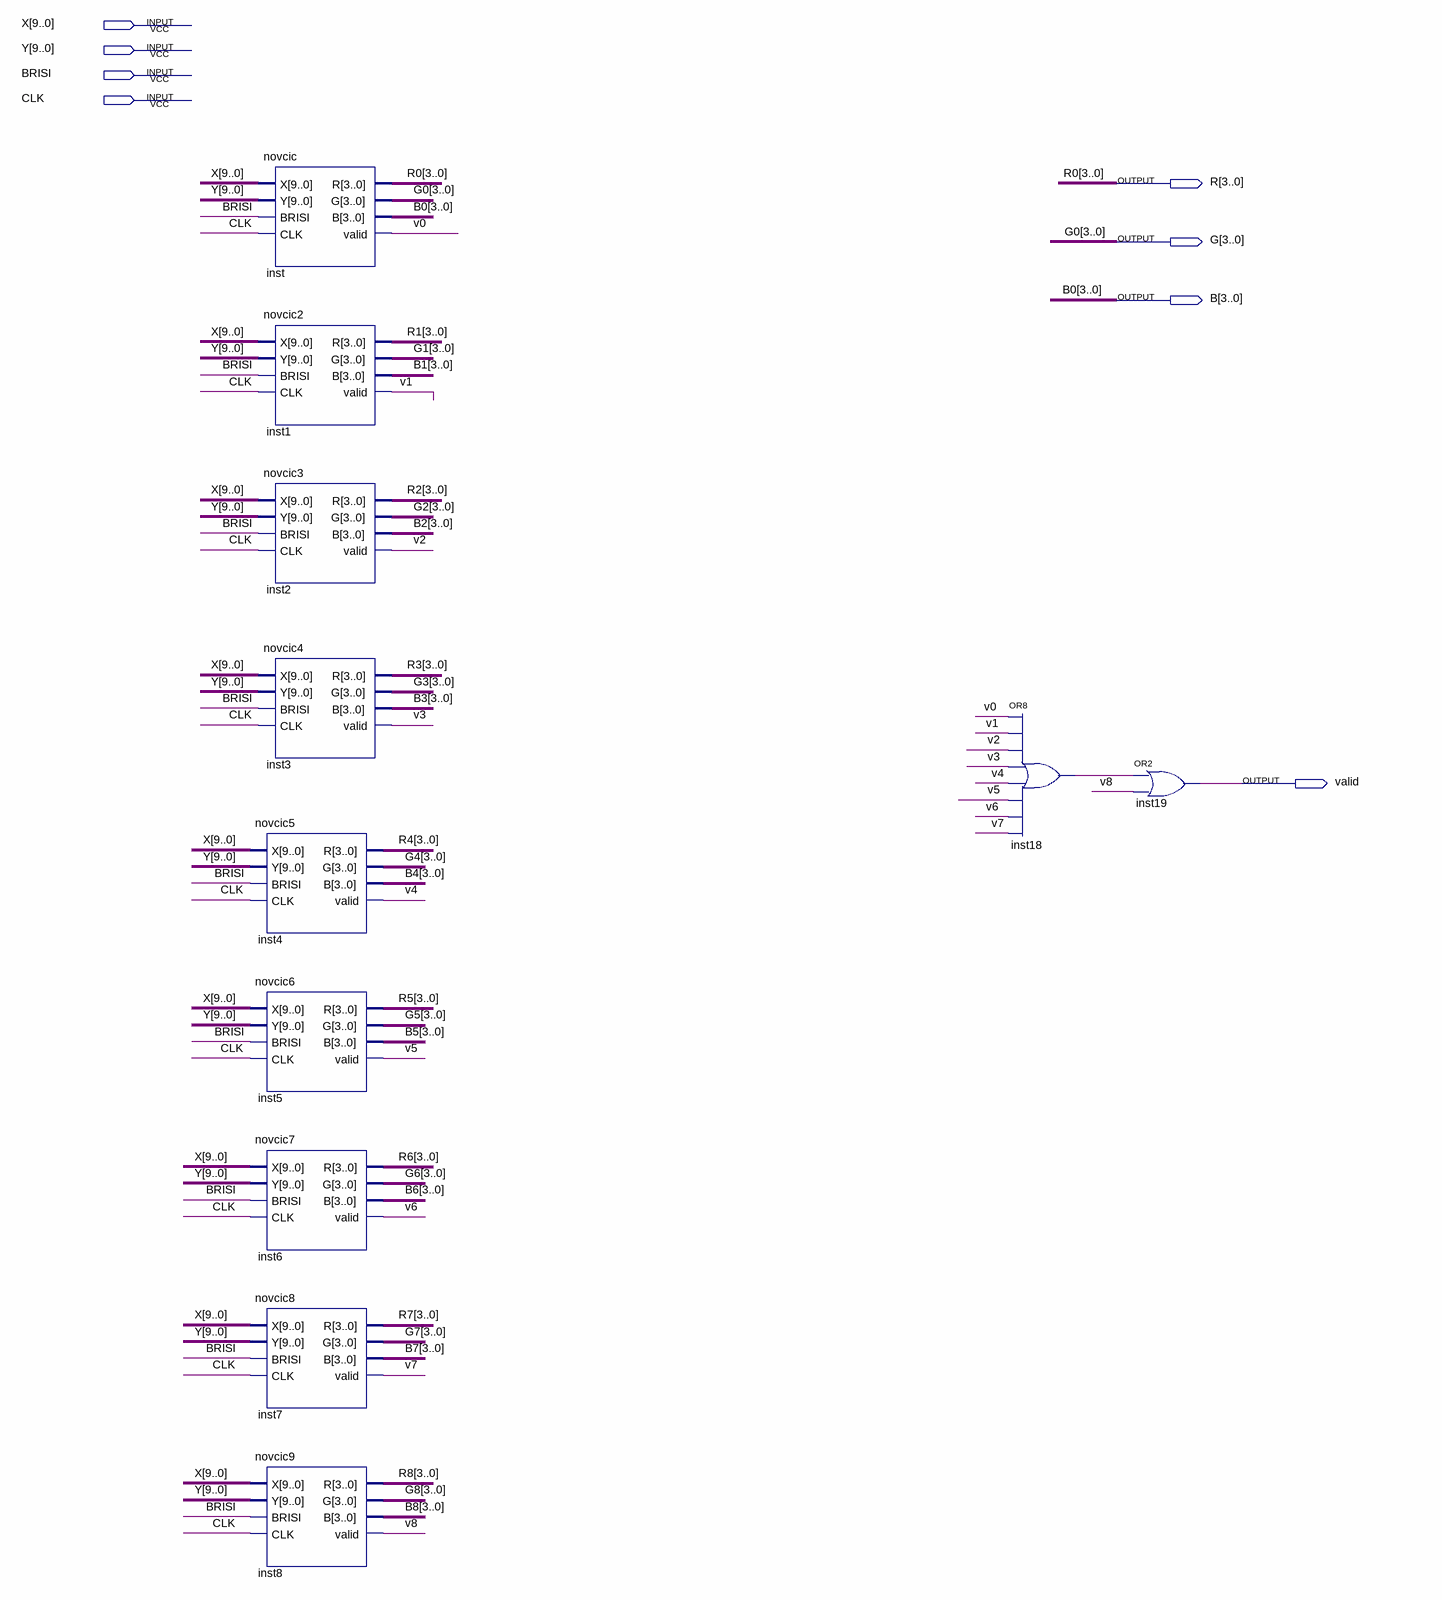
[diagram p0: schematic sheet]
// Quartus schematic novcici.bdf as structural Verilog: 11 symbols, 8 pins
module novcici (
  input  [9:0] X,
  input  [9:0] Y,
  input  BRISI,
  input  CLK,
  output [3:0] R,
  output [3:0] G,
  output [3:0] B,
  output valid
);

  wire inst18_out, v0, v1, v2, v3, v4, v5, v6, v7, v8;
  wire [3:0] B1, B2, B3, B4, B5, B6, B7, B8, G1, G2, G3, G4, G5, G6, G7, G8, R1, R2, R3, R4, R5, R6, R7, R8;

  novcic5 inst4 (.X(X), .Y(Y), .BRISI(BRISI), .CLK(CLK), .R(R4), .G(G4), .B(B4), .valid(v4));
  novcic6 inst5 (.X(X), .Y(Y), .BRISI(BRISI), .CLK(CLK), .R(R5), .G(G5), .B(B5), .valid(v5));
  novcic7 inst6 (.X(X), .Y(Y), .BRISI(BRISI), .CLK(CLK), .R(R6), .G(G6), .B(B6), .valid(v6));
  novcic8 inst7 (.X(X), .Y(Y), .BRISI(BRISI), .CLK(CLK), .R(R7), .G(G7), .B(B7), .valid(v7));
  novcic9 inst8 (.X(X), .Y(Y), .BRISI(BRISI), .CLK(CLK), .R(R8), .G(G8), .B(B8), .valid(v8));
  novcic inst (.X(X), .Y(Y), .BRISI(BRISI), .CLK(CLK), .R(R), .G(G), .B(B), .valid(v0));
  novcic2 inst1 (.X(X), .Y(Y), .BRISI(BRISI), .CLK(CLK), .R(R1), .G(G1), .B(B1), .valid(v1));
  novcic3 inst2 (.X(X), .Y(Y), .BRISI(BRISI), .CLK(CLK), .R(R2), .G(G2), .B(B2), .valid(v2));
  novcic4 inst3 (.X(X), .Y(Y), .BRISI(BRISI), .CLK(CLK), .R(R3), .G(G3), .B(B3), .valid(v3));
  or inst18 (inst18_out, v0, v1, v2, v3, v4, v5, v6, v7);
  or inst19 (valid, inst18_out, v8);

  // Other names for the same wires on the sheet: B0[3:0] = B; G0[3:0] = G; R0[3:0] = R
endmodule
